# Altium schematic sheet Charger.SchDoc
size A2; SheetNumber: 3; SheetTotal: 9
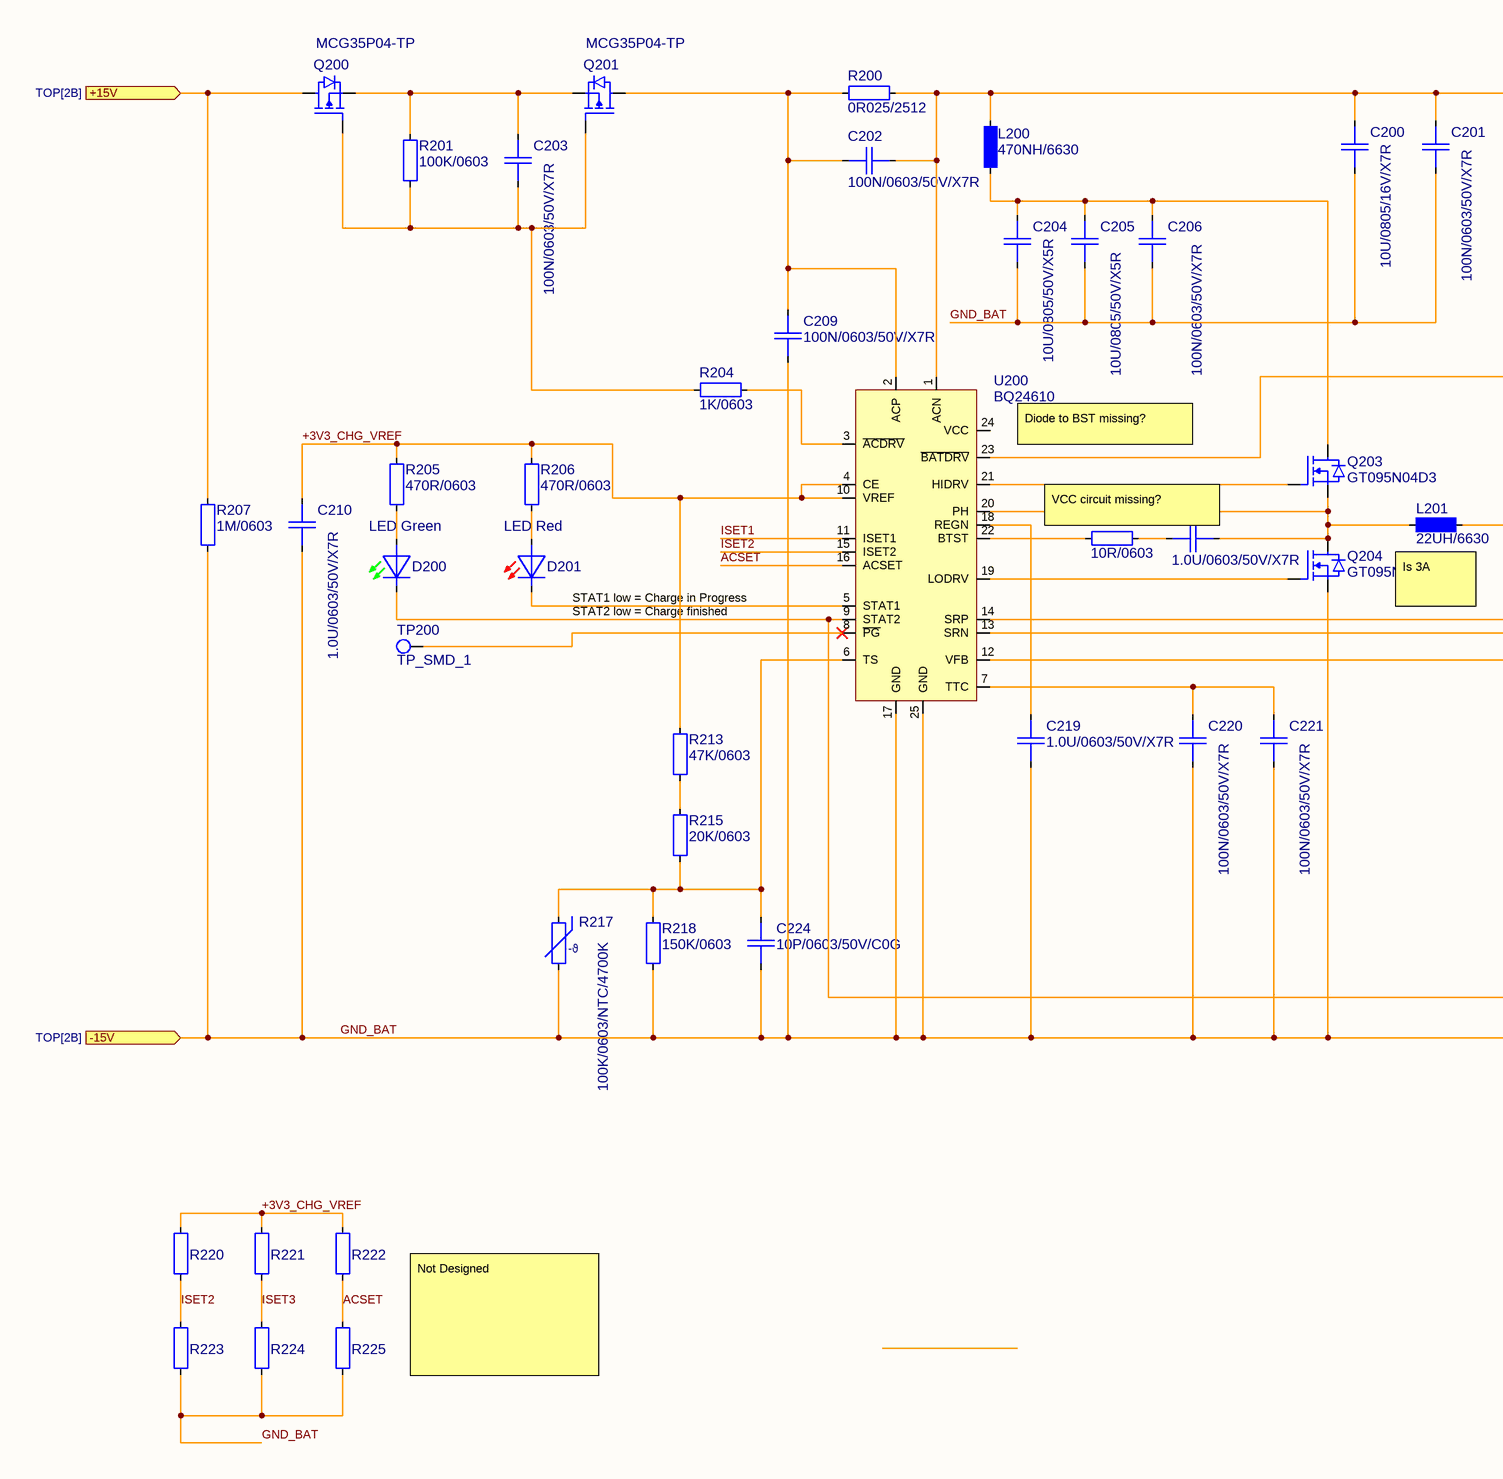
[diagram p0: Charger.SchDoc, left]
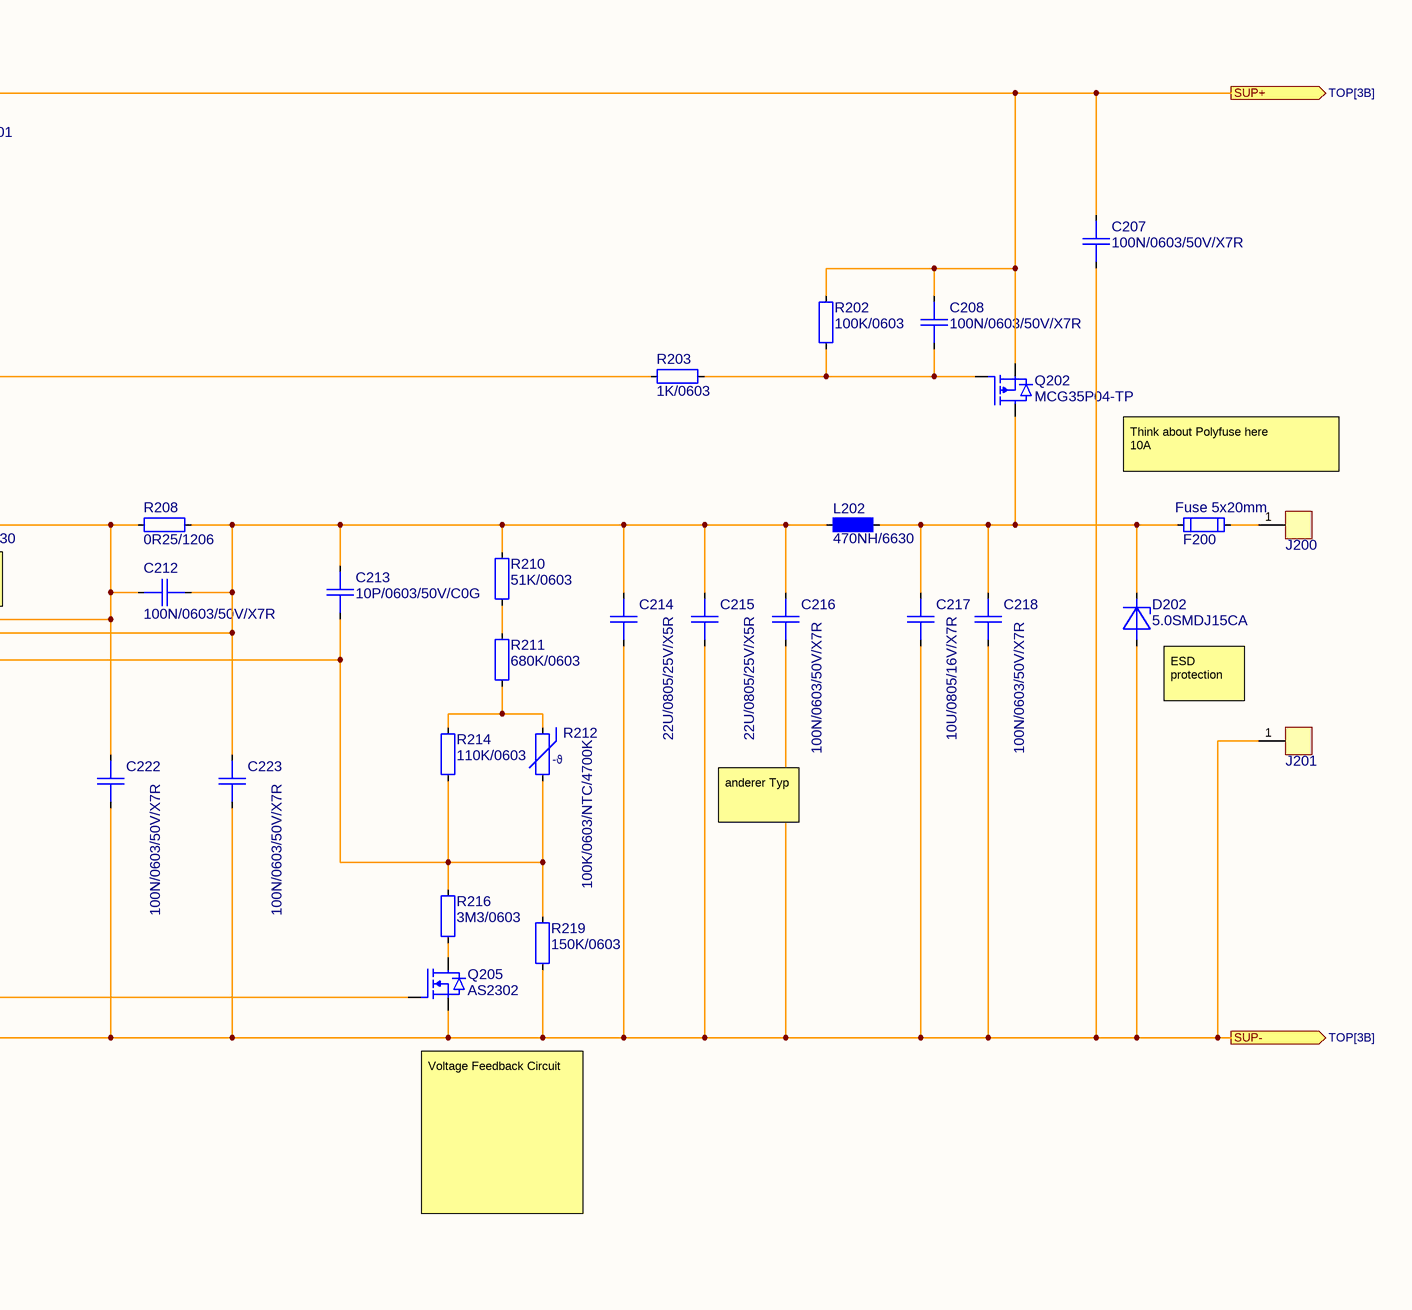
[diagram p1: Charger.SchDoc, right]

## Parts
C200  10U/0805/16V/X7R  [CAP0805_X7R]
C201  100N/0603/50V/X7R  [CAP0603_X7R]
C202  100N/0603/50V/X7R  [CAP0603_X7R]
C203  100N/0603/50V/X7R  [CAP0603_X7R]
C204  10U/0805/50V/X5R  [CAP0805_X7R]
C205  10U/0805/50V/X5R  [CAP0805_X7R]
C206  100N/0603/50V/X7R  [CAP0603_X7R]
C207  100N/0603/50V/X7R  [CAP0603_X7R]
C208  100N/0603/50V/X7R  [CAP0603_X7R]
C209  100N/0603/50V/X7R  [CAP0603_X7R]
C210  1.0U/0603/50V/X7R  [CAP0603_X7R]
C211  1.0U/0603/50V/X7R  [CAP0603_X7R]
C212  100N/0603/50V/X7R  [CAP0603_X7R]
C213  10P/0603/50V/C0G  [CAP0603_C0G]
C214  22U/0805/25V/X5R  [CAP0805_X7R]
C215  22U/0805/25V/X5R  [CAP0805_X7R]
C216  100N/0603/50V/X7R  [CAP0603_X7R]
C217  10U/0805/16V/X7R  [CAP0805_X7R]
C218  100N/0603/50V/X7R  [CAP0603_X7R]
C219  1.0U/0603/50V/X7R  [CAP0603_X7R]
C220  100N/0603/50V/X7R  [CAP0603_X7R]
C221  100N/0603/50V/X7R  [CAP0603_X7R]
C222  100N/0603/50V/X7R  [CAP0603_X7R]
C223  100N/0603/50V/X7R  [CAP0603_X7R]
C224  10P/0603/50V/C0G  [CAP0603_C0G]
D200  LED Green  [LED0603_GREEN]
D201  LED Red  [LED0603_RED]
D202  5.0SMDJ15CA  [DIOM7959X265]
F200  Fuse 5x20mm  [OGN_THR]
J200  6.35mmx0.81mm Tab THT  [Tab_THT_635]  (value not drawn)
J201  6.35mmx0.81mm Tab THT  [Tab_THT_635]  (value not drawn)
L200  470NH/6630  [INDM660730X30]
L201  22UH/6630  [INDM660730X30]
L202  470NH/6630  [INDM660730X30]
Q200  MCG35P04-TP  [SON065P330X330X075-5-TH245X175]
Q201  MCG35P04-TP  [SON065P330X330X075-5-TH245X175]
Q202  MCG35P04-TP  [SON065P330X330X075-5-TH245X175]
Q203  GT095N04D3  [SON065P330X330X075-5-TH245X175]
Q204  GT095N04D3  [SON065P330X330X075-5-TH245X175]
Q205  AS2302  [SOT2395P280X125-3-SE]
R200  0R025/2512  [R2512-0.65-WW]
R201  100K/0603  [R0603-0.40-WW]
R202  100K/0603  [R0603-0.40-WW]
R203  1K/0603  [R0603-0.40-WW]
R204  1K/0603  [R0603-0.40-WW]
R205  470R/0603  [R0603-0.40-WW]
R206  470R/0603  [R0603-0.40-WW]
R207  1M/0603  [R0603-0.40-WW]
R208  0R25/1206  [R1206-0.80-WW]
R209  10R/0603  [R0603-0.40-WW]
R210  51K/0603  [R0603-0.40-WW]
R211  680K/0603  [R0603-0.40-WW]
R212  100K/0603/NTC/4700K  [R0603-0.40-WW]
R213  47K/0603  [R0603-0.40-WW]
R214  110K/0603  [R0603-0.40-WW]
R215  20K/0603  [R0603-0.40-WW]
R216  3M3/0603  [R0603-0.40-WW]
R217  100K/0603/NTC/4700K  [R0603-0.40-WW]
R218  150K/0603  [R0603-0.40-WW]
R219  150K/0603  [R0603-0.40-WW]
R220  10K/0603  [R0603-0.40-WW]  (value not drawn)
R221  10K/0603  [R0603-0.40-WW]  (value not drawn)
R222  10K/0603  [R0603-0.40-WW]  (value not drawn)
R223  10K/0603  [R0603-0.40-WW]  (value not drawn)
R224  10K/0603  [R0603-0.40-WW]  (value not drawn)
R225  10K/0603  [R0603-0.40-WW]  (value not drawn)
TP200  TP_SMD_1  [TP_SMD_1]  (no BOM)
U200  BQ24610  [QFN050P400X400X100-24-TH245X245]

## Ports
+15V (in, see TOP[2B]), -15V (in, see TOP[2B]), SUP+ (out, see TOP[3B]), SUP- (out, see TOP[3B])

## Nets
+3V3_CHG_VREF: C210.1 R205.1 R206.1 R213.1 R220.1 R221.1 R222.1 U200.4(CE) U200.10(VREF)
+15V: Q200.D(DRAIN) R207.1 ; port +15V
ACSET: R222.2 R225.1 U200.16(ACSET)
GND_BAT: C200.2 C201.2 C204.2 C205.2 C206.2 C207.2 C209.2 C210.2 C214.2 C215.2 C216.2 C217.2 C218.2 C219.1 C220.2 C221.2 C222.2 C223.2 C224.2 D202.2 J201.1 Q204.S(SOURCE) Q205.2(SOURCE) R207.2 R217.2 R218.2 R219.2 R223.2 R224.2 R225.2 U200.17(GND) U200.25(GND) ; port -15V, port SUP-
ISET1: U200.11(ISET1)
ISET2: R220.2 R223.1 U200.15(ISET2)
ISET3: R221.2 R224.1
SUP+: C200.1 C201.1 C202.2 C207.1 C208.1 L200.1 Q202.S(SOURCE) R200.2 R202.1 U200.1(ACN) ; port SUP+
NetC202_1: C202.1 C209.1 Q201.D(DRAIN) R200.1 U200.2(ACP)
NetC203_1: C203.1 Q200.S(SOURCE) Q201.S(SOURCE) R201.1
NetC203_2: C203.2 Q200.G(GATE) Q201.G(GATE) R201.2 R204.1
NetC204_1: C204.1 C205.1 C206.1 L200.2 Q203.D(DRAIN)
NetC208_2: C208.2 Q202.G(GATE) R202.2 R203.2
NetC211_1: C211.1 R209.2
NetC211_2: C211.2 L201.1 Q203.S(SOURCE) Q204.D(DRAIN) U200.20(PH)
NetC212_1: C212.1 C222.1 L201.2 R208.1 U200.14(SRP)
NetC212_2: C212.2 C213.1 C214.1 C215.1 C216.1 C223.1 L202.2 R208.2 R210.1 U200.13(SRN)
NetC213_2: C213.2 R212.2 R214.2 R216.1 R219.1 U200.12(VFB)
NetC217_1: C217.1 C218.1 D202.1 F200.1 L202.1 Q202.D(DRAIN)
NetC219_2: C219.2 U200.18(REGN)
NetC220_1: C220.1 C221.1 U200.7(TTC)
NetC224_1: C224.1 R215.2 R217.1 R218.1 U200.6(TS)
NetD200_1: D200.1 Q205.1(GATE) U200.9(STAT2)
NetD200_2: D200.2 R205.2
NetD201_1: D201.1 U200.5(STAT1)
NetD201_2: D201.2 R206.2
NetF200_2: F200.2 J200.1
NetQ203_G: Q203.G(GATE) U200.21(HIDRV)
NetQ204_G: Q204.G(GATE) U200.19(LODRV)
NetQ205_3: Q205.3(DRAIN) R216.2
NetR203_1: R203.1 U200.23(~{BATDRV})
NetR204_2: R204.2 U200.3(~{ACDRV})
NetR209_1: R209.1 U200.22(BTST)
NetR210_2: R210.2 R211.1
NetR211_2: R211.2 R212.1 R214.1
NetR213_2: R213.2 R215.1
NetTP200_1: TP200.1 U200.8(~{PG})

Not connected (* = marked no-connect by the designer): U200 24(VCC)

## Notes on the sheet
- (near U200) Diode to BST missing?
- VCC circuit missing?
- Think about Polyfuse here
  10A
- (near D201) STAT1 low = Charge in Progress
- (near D201) STAT2 low = Charge finished
- (near L201) Is 3A
- (near D202) ESD protection
- anderer Typ
- Voltage Feedback Circuit
- Not Designed
- Date:
- Schema:
- Layout:
- Size:
- A3
- (in symbol 100K/0603/NTC/4700K) -ϑ

## Library data of the parts
C200 C217 = 10U/0805/16V/X7R: CAP SM 0805 10uF 16V X7R; Manufacturer: GENERIC; Manufacturer 1: Cal-Chip Electronics, Inc.; Manufacturer Part Number 1: GMC21X7R106K16NT; Absolute Value: 1E-5; Eurocircuits GPN: GPN0805106-16; Part Number: 10U/0805/16V/X7R; Package: 0805; Value: 10uF; HelpURL: https://88ce57.p3cdn1.secureserver.net/wp-content/uploads/2023/01/gmc_series-2.pdf; Supplier 1: Digi-Key; Supplier Part Number 1: 4713-GMC21X7R106K16NTCT-ND; Manufacturer 2: Samsung Electro-Mechanics; Manufacturer Part Number 2: CL21B106KOQNNNE; Supplier 2: Digi-Key; Supplier Part Number 2: 1276-2872-1-ND; Supplier 3: LCSC; Supplier Part Number 3: C95841; JLC Type: Basic
C201-C203 C206-C209 C212 C216 C218 C220-C223 = 100N/0603/50V/X7R: CAP SM 0603 100nF 50V X7R; Manufacturer: GENERIC; Manufacturer 1: YAGEO; Manufacturer Part Number 1: CC0603KPX7R9BB104; Absolute Value: 1E-7; Eurocircuits GPN: GPC0603104; Part Number: 100N/0603/50V/X7R; Package: 0603; Value: 100nF; HelpURL: https://www.yageo.com/upload/media/product/app/datasheet/mlcc/upy-gphc_x7r_6_3v-to-250v.pdf; Supplier 1: Digi-Key; Supplier Part Number 1: 311-3567-1-ND; Manufacturer 2: YAGEO; Manufacturer Part Number 2: CC0603MRX7R9BB104; Supplier 2: Digi-Key; Supplier Part Number 2: 311-4110-1-ND; Supplier 3: LCSC; Supplier Part Number 3: C14663; JLC Type: Basic
C204 C205 = 10U/0805/50V/X5R: CAP SM 0805 10uF 50V X5R; Manufacturer: GENERIC; Manufacturer 1: Murata Electronics; Manufacturer Part Number 1: GRM21BR61H106KE43K; Absolute Value: 1E-5; Eurocircuits GPN: GPN0805106-50-X5R; Part Number: 10U/0805/50V/X5R; Package: 0805; Value: 10uF; HelpURL: https://search.murata.co.jp/Ceramy/image/img/A01X/G101/ENG/GRM21BR61H106KE43-01A.pdf; Supplier 1: Digi-Key; Supplier Part Number 1: 490-GRM21BR61H106KE43KCT-ND; Manufacturer Part Number 3: GRM21BR61H106KE43L; Supplier 3: LCSC; Supplier Part Number 3: C440198; JLC Type: Basic
C210 C211 C219 = 1.0U/0603/50V/X7R: CAP SM 0603 1.0uF 50V X7R; Manufacturer: GENERIC; Manufacturer 1: YAGEO; Manufacturer Part Number 1: CC0603KRX7R9BB105; Absolute Value: 1E-6; Eurocircuits GPN: GPC0603105; Part Number: 1.0U/0603/50V/X7R; Package: 0603; Value: 1.0uF; HelpURL: https://www.yageo.com/upload/media/product/app/datasheet/mlcc/upy-gphc_x7r_6_3v-to-250v.pdf; Supplier 1: Digi-Key; Supplier Part Number 1: 311-2082-1-ND
C213 C224 = 10P/0603/50V/C0G: CAP SM 0603 10pF 50V C0G; Manufacturer: GENERIC; Manufacturer 1: YAGEO; Manufacturer Part Number 1: CC0603JRNPO9BN100; Absolute Value: 1E-11; Eurocircuits GPN: GPC0603100-C0G; Part Number: 10P/0603/50V/C0G; Package: 0603; Value: 10pF; HelpURL: https://www.yageo.com/upload/media/product/productsearch/datasheet/mlcc/UPY-GP_NP0_16V-to-50V_18.pdf; Supplier 1: Digi-Key; Supplier Part Number 1: 311-1058-1-ND; Manufacturer 2: YAGEO; Manufacturer Part Number 2: CC0603KRNPO9BN100; Supplier 2: Digi-Key; Supplier Part Number 2: 311-4025-1-ND
C214 C215 = 22U/0805/25V/X5R: CAP SM 0805 22uF 25V X5R; Manufacturer: GENERIC; Manufacturer 1: Samsung Electro-Mechanics; Manufacturer Part Number 1: CL21A226MAYNNNE; Absolute Value: 2.2E-5; Eurocircuits GPN: GPN0805106-25; Part Number: 22U/0805/25V/X5R; Package: 0805; Value: 22uF; HelpURL: https://mm.digikey.com/Volume0/opasdata/d220001/medias/docus/339/CL21A226MAYNNNE_Spec.pdf; Supplier 1: Digi-Key; Supplier Part Number 1: 1276-CL21A226MAYNNNECT-ND; Manufacturer Part Number 3: CL21A226MAQNNNE; Supplier 3: LCSC; Supplier Part Number 3: C45783; JLC Type: Basic
D200 = LED Green 0603: Generic LED Green 0603; Manufacturer 1: Würth; Manufacturer Part Number 1: 150060VS75000; Part Number: LED Green 0603; Manufacturer: GENERIC; Package: 603; Value: Green; Absolute Value: Green; HelpURL: https://www.we-online.com/katalog/datasheet/150060VS75000.pdf; Supplier 1: Digi-Key; Supplier Part Number 1: 732-4980-1-ND; Manufacturer 3: Everlight Elec; Manufacturer Part Number 3: 19-217/GHC-YR1S2/3T; Supplier 3: LCSC; Supplier Part Number 3: C72043; JLC Type: Basic
D201 = LED Red 0603: Generic LED Red 0603; Manufacturer 1: Würth; Manufacturer Part Number 1: 150060RS75000; Part Number: LED Red 0603; Manufacturer: GENERIC; Package: 603; Value: Red; Absolute Value: Red; HelpURL: https://www.we-online.com/katalog/datasheet/150060RS75000.pdf; Supplier 1: Digi-Key; Supplier Part Number 1: 732-4978-1-ND; Manufacturer 3: Hubei KENTO Elec; Manufacturer Part Number 3: KT-0603R; Supplier 3: LCSC; Supplier Part Number 3: C2286; JLC Type: Basic
D202 = 5.0SMDJ15CA: TVS DIODE 15VWM 24.4V DO214 TR13; Manufacturer: Littelfuse Inc.; Manufacturer Part Number 1: 5.0SMDJ15CAS; Absolute Value: 15V; Part Number: 5.0SMDJ15CA; Package: DO-214AB, SMC; Value: 5.0SMDJ15CA; HelpURL: https://m.littelfuse.com/~/media/electronics/datasheets/tvs_diodes/littelfuse_tvs_diode_5_0smdjxxs_datasheet.pdf.pdf; Manufacturer 1: Littelfuse Inc.; Supplier 1: Digi-Key; Supplier Part Number 1: 18-5.0SMDJ15CASCT-ND; Manufacturer 2: Littelfuse Inc.; Manufacturer Part Number 2: 5.0SMDJ15CA; Supplier 2: Digi-Key; Supplier Part Number 2: 5.0SMDJ15CACT-ND
F200 = Fuse/5x20mm/OGN: open fuse holder, 5 x 20 mm, THR, IEC 60335-1; Manufacturer: Schurter; Manufacturer Part Number 1: 3-132-873; Part Number: Fuse/5x20mm/OGN; Package: 5X20; HelpURL: https://www.schurter.com/en/datasheet/typ_OGN.pdf; Manufacturer 1: Schurter; Supplier 1: Digi-Key; Supplier Part Number 1: 486-3-132-873-ND
J200 J201 = Tab_025_THT: CONN QC TAB 0.250 SOLDER; Manufacturer: GENERIC; Manufacturer 1: TE Connectivity AMP Connectors; Manufacturer Part Number 1: 1217861-1; Part Number: Tab_025_THT; HelpURL: https://www.te.com/usa-en/product-1217861-1.datasheet.pdf; Supplier 1: Digi-Key; Supplier Part Number 1: A100452CT-ND; Manufacturer 3: TE Connectivity; Manufacturer Part Number 3: 1217861-1; Supplier 3: LCSC; Supplier Part Number 3: C428480
L200 L202 = 470NH/6630: FIXED IND 470NH 16.5 A 5.5 MOHM SMD; Manufacturer: GENERIC; Manufacturer 1: Pulse Electronics; Manufacturer Part Number 1: BMRA00060630R47MA1; Absolute Value: 4.7E-7; Part Number: 470NH/6630; Package: 6030 Inductor; Value: 470NH; HelpURL: https://productfinder.pulseelectronics.com/api/open/part-attachments/datasheet/BMRA00060630R47MA1; Supplier 1: Digi-Key; Supplier Part Number 1: 553-BMRA00060630R47MA1CT-ND
L201 = 22UH/6630: FIXED IND 22UH     3 A 145 MOHM SMD; Manufacturer: GENERIC; Manufacturer 1: Pulse Electronics; Manufacturer Part Number 1: BMRA00060630220MA1; Absolute Value: 2.2E-5; Part Number: 22UH/6630; Package: 6030 Inductor; Value: 22UH; HelpURL: https://productfinder.pulseelectronics.com/api/open/part-attachments/datasheet/BMRA00060630220MA1; Supplier 1: Digi-Key; Supplier Part Number 1: 553-BMRA00060630220MA1CT-ND
Q200-Q202 = MCG35P04-TP: 40V 35A P-Channel MOSFET; Manufacturer: Micro Commercial Co; Manufacturer Part Number 1: 353-MCG35P04-TPCT-ND; Part Number: MCG35P04-TP; HelpURL: https://www.mccsemi.com/pdf/Products/MCG35P04(DFN3333).pdf; Manufacturer 1: Micro Commercial Co; Supplier 1: Digi-Key; Supplier Part Number 1: 353-MCG35P04-TPCT-ND
Q203 Q204 = GT095N04D3: 40V 47A N-Channel MOSFET; Manufacturer: Goford Semiconductor; Part Number: GT095N04D3; HelpURL: http://www.gofordsemi.com/u_file/product/834/GOFORD-GT095N04D3.pdf; Manufacturer 1: Goford Semiconductor; Manufacturer Part Number 1: GT095N04D3; Supplier 1: Digi-Key; Supplier Part Number 1: 3141-GT095N04D3CT-ND
Q205 = AS2302: N-Channel 20V(D-S) MOSFET; Manufacturer: GENERIC; Manufacturer 1: ANBON SEMICONDUCTOR (INT'L) LIMITED; Part Number: AS2302; Package: SOT23; HelpURL: https://datasheet.lcsc.com/lcsc/1809211431_AnBon-AS2302_C232266.pdf; Manufacturer Part Number 1: AS2302; Supplier 1: Digi-Key; Supplier Part Number 1: 4530-AS2302CT-ND; Manufacturer 3: AnBon; Manufacturer Part Number 3: AS2302; Supplier 3: LCSC; Supplier Part Number 3: C232266; JLC Type: Extended
R200 = 0R025/2512: RES SM 2512 0R025; Manufacturer: GENERIC; Manufacturer 1: Ohmite; Manufacturer Part Number 1: MCS3264R025FER; Absolute Value: 0.025; Part Number: 0R025/2512; Package: 2512; Value: 0R025; HelpURL: https://www.ohmite.com/assets/docs/res_mcs.pdf?r=false; Supplier 1: Digi-Key; Supplier Part Number 1: MCS3264R025FERCT-ND
R201 R202 = 100K/0603: RES SM 0603 100K; Manufacturer: GENERIC; Manufacturer 1: YAGEO; Manufacturer Part Number 1: RC0603FR-13100KL; Absolute Value: 100000; Eurocircuits GPN: GPR0603100K; Part Number: 100K/0603; Package: 0603; Value: 100K; HelpURL: https://www.yageo.com/upload/media/product/productsearch/datasheet/rchip/PYu-RC_Group_51_RoHS_L_12.pdf; Supplier 1: Digi-Key; Supplier Part Number 1: 13-RC0603FR-13100KLCT-ND; Manufacturer 2: YAGEO; Manufacturer Part Number 2: RC0603FR-10100KL; Supplier 2: Digi-Key; Supplier Part Number 2: 13-RC0603FR-10100KLCT-ND; Manufacturer 3: UNI-ROYAL(Uniroyal Elec); Manufacturer Part Number 3: 0603WAF1003T5E; Supplier 3: LCSC; Supplier Part Number 3: C25803; JLC Type: Basic
R203 R204 = 1K/0603: RES SM 0603 1K; Manufacturer: GENERIC; Manufacturer 1: YAGEO; Manufacturer Part Number 1: RC0603FR-131KL; Absolute Value: 1000; Eurocircuits GPN: GPR06031K; Part Number: 1K/0603; Package: 0603; Value: 1K; HelpURL: https://www.yageo.com/upload/media/product/app/datasheet/rchip/pyu-rc_group_51_rohs_l.pdf; Supplier 1: Digi-Key; Supplier Part Number 1: 13-RC0603FR-131KLCT-ND; Manufacturer 2: YAGEO; Manufacturer Part Number 2: RC0603FR-101KL; Supplier 2: Digi-Key; Supplier Part Number 2: 13-RC0603FR-101KLCT-ND; Manufacturer 3: UNI-ROYAL(Uniroyal Elec); Manufacturer Part Number 3: 0603WAF1001T5E; Supplier 3: LCSC; Supplier Part Number 3: C21190; JLC Type: Basic
R205 R206 = 470R/0603: RES SM 0603 470R; Manufacturer: GENERIC; Manufacturer 1: YAGEO; Manufacturer Part Number 1: RC0603FR-13470RL; Absolute Value: 470; Eurocircuits GPN: GPR0603470R; Part Number: 470R/0603; Package: 0603; Value: 470R; HelpURL: https://www.yageo.com/upload/media/product/app/datasheet/rchip/pyu-rc_group_51_rohs_l.pdf; Supplier 1: Digi-Key; Supplier Part Number 1: 13-RC0603FR-13470RLCT-ND; Manufacturer 2: YAGEO; Manufacturer Part Number 2: RC0603FR-10470RL; Supplier 2: Digi-Key; Supplier Part Number 2: 13-RC0603FR-10470RLCT-ND
R207 = 1M/0603: RES SM 0603 1M; Manufacturer: GENERIC; Manufacturer 1: YAGEO; Manufacturer Part Number 1: RC0603FR-131ML; Absolute Value: 1000000; Eurocircuits GPN: GPR06031M; Part Number: 1M/0603; Package: 0603; Value: 1M; HelpURL: https://www.yageo.com/upload/media/product/app/datasheet/rchip/pyu-rc_group_51_rohs_l.pdf; Supplier 1: Digi-Key; Supplier Part Number 1: 13-RC0603FR-131MLCT-ND; Manufacturer 2: YAGEO; Manufacturer Part Number 2: RC0603FR-101ML; Supplier 2: Digi-Key; Supplier Part Number 2: 13-RC0603FR-101MLCT-ND; Manufacturer 3: UNI-ROYAL(Uniroyal Elec); Manufacturer Part Number 3: 0603WAF1004T5E; Supplier 3: C22935; Supplier Part Number 3: LCSC; JLC Type: Basic
R208 = 0R25/1206: RES SM 1206 0R25; Manufacturer: GENERIC; Manufacturer 1: YAGEO; Manufacturer Part Number 1: RC1206FR-0715RL; Absolute Value: 0.25; Eurocircuits GPN: GPR12060R25; Part Number: 0R25/1206; Package: 1206; Value: 0R25; HelpURL: https://www.yageo.com/upload/media/product/app/datasheet/rchip/pyu-rl_group_521_rohs_l.pdf; Supplier 1: Digi-Key; Supplier Part Number 1: 311-.25LWCT-ND; Manufacturer 3: RALEC; Manufacturer Part Number 3: RLT06R25JTP; Supplier 3: LCSC; Supplier Part Number 3: C7500327
R209 = 10R/0603: RES SM 0603 10R; Manufacturer: GENERIC; Manufacturer 1: YAGEO; Manufacturer Part Number 1: RC0603FR-1310RL; Absolute Value: 10; Eurocircuits GPN: GPR060310R; Part Number: 10R/0603; Package: 0603; Value: 10R; HelpURL: https://www.yageo.com/upload/media/product/app/datasheet/rchip/pyu-rc_group_51_rohs_l.pdf; Supplier 1: Digi-Key; Supplier Part Number 1: 13-RC0603FR-1310RLCT-ND; Manufacturer 2: YAGEO; Manufacturer Part Number 2: RC0603FR-1010RL; Supplier 2: Digi-Key; Supplier Part Number 2: 13-RC0603FR-1010RLCT-ND
R210 = 51K/0603: RES SM 0603 51K; Manufacturer: GENERIC; Manufacturer 1: YAGEO; Manufacturer Part Number 1: RC0603FR-1351KL; Absolute Value: 51000; Eurocircuits GPN: GPR060351K; Part Number: 51K/0603; Package: 0603; Value: 51K; HelpURL: https://www.yageo.com/upload/media/product/app/datasheet/rchip/pyu-rc_group_51_rohs_l.pdf; Supplier 1: Digi-Key; Supplier Part Number 1: 13-RC0603FR-1351KLCT-ND; Manufacturer 2: YAGEO; Manufacturer Part Number 2: RC0603FR-1051KL; Supplier 2: Digi-Key; Supplier Part Number 2: 13-RC0603FR-1051KLCT-ND; Supplier 3: LCSC; Supplier Part Number 3: C2933234; JLC Type: Basic
R211 = 680K/0603: RES SM 0603 680K; Manufacturer: GENERIC; Manufacturer 1: YAGEO; Manufacturer Part Number 1: RC0603FR-13680KL; Absolute Value: 680000; Eurocircuits GPN: GPR0603680K; Part Number: 680K/0603; Package: 0603; Value: 680K; HelpURL: https://www.yageo.com/upload/media/product/app/datasheet/rchip/pyu-rc_group_51_rohs_l.pdf; Supplier 1: Digi-Key; Supplier Part Number 1: 13-RC0603FR-13680KLCT-ND; Manufacturer 2: YAGEO; Manufacturer Part Number 2: RC0603FR-07680KL; Supplier 2: Digi-Key; Supplier Part Number 2: 311-680KHRCT-ND
R212 R217 = 100K/0603/NTC/4700K: RES NTC SM 0603 100k 4700K; Manufacturer: GENERIC; Manufacturer 1: Panasonic Electronic Components; Manufacturer Part Number 1: ERT-J1VV104F; Absolute Value: 100000; Part Number: 100K/0603/NTC/4700K; Package: 0603; Value: 100K; HelpURL: https://industrial.panasonic.com/cdbs/www-data/pdf/AUA0000/AUA0000C8.pdf; Supplier 1: Digi-Key; Supplier Part Number 1: P124047CT-ND
R213 = 47K/0603: RES SM 0603 47K; Manufacturer: GENERIC; Manufacturer 1: YAGEO; Manufacturer Part Number 1: RC0603FR-1347KL; Absolute Value: 47000; Eurocircuits GPN: GPR060347K; Part Number: 47K/0603; Package: 0603; Value: 47K; HelpURL: https://www.yageo.com/upload/media/product/app/datasheet/rchip/pyu-rc_group_51_rohs_l.pdf; Supplier 1: Digi-Key; Supplier Part Number 1: 13-RC0603FR-1347KLCT-ND; Manufacturer 2: YAGEO; Manufacturer Part Number 2: RC0603FR-1047KL; Supplier 2: Digi-Key; Supplier Part Number 2: 13-RC0603FR-1047KLCT-ND; Manufacturer 3: UNI-ROYAL(Uniroyal Elec); Manufacturer Part Number 3: 0603WAF4702T5E; Supplier 3: LCSC; Supplier Part Number 3: C25819; JLC Type: Basic
R214 = 110K/0603: RES SM 0603 110K; Manufacturer: GENERIC; Manufacturer 1: YAGEO; Manufacturer Part Number 1: RC0603FR-13110KL; Absolute Value: 110000; Eurocircuits GPN: GPR0603110K; Part Number: 110K/0603; Package: 0603; Value: 110K; HelpURL: https://www.yageo.com/upload/media/product/productsearch/datasheet/rchip/PYu-RC_Group_51_RoHS_L_12.pdf; Supplier 1: Digi-Key; Supplier Part Number 1: 13-RC0603FR-13110KLCT-ND; Manufacturer 2: YAGEO; Manufacturer Part Number 2: RC0603FR-07110KL; Supplier 2: Digi-Key; Supplier Part Number 2: 311-110KHRCT-ND
R215 = 20K/0603: RES SM 0603 20K; Manufacturer: GENERIC; Manufacturer 1: YAGEO; Manufacturer Part Number 1: RC0603FR-1320KL; Absolute Value: 20000; Eurocircuits GPN: GPR060320K; Part Number: 20K/0603; Package: 0603; Value: 20K; HelpURL: https://www.yageo.com/upload/media/product/app/datasheet/rchip/pyu-rc_group_51_rohs_l.pdf; Supplier 1: Digi-Key; Supplier Part Number 1: 13-RC0603FR-1320KLCT-ND; Manufacturer 2: YAGEO; Manufacturer Part Number 2: RC0603FR-1020KL; Supplier 2: Digi-Key; Supplier Part Number 2: 13-RC0603FR-1020KLCT-ND
R216 = 3M3/0603: RES SM 0603 3M3; Manufacturer: GENERIC; Manufacturer 1: YAGEO; Manufacturer Part Number 1: RC0603FR-073M3L; Absolute Value: 3300000; Eurocircuits GPN: GPR06033M3; Part Number: 3M3/0603; Package: 0603; Value: 3M3; HelpURL: https://www.yageo.com/upload/media/product/app/datasheet/rchip/pyu-rc_group_51_rohs_l.pdf; Supplier 1: Digi-Key; Supplier Part Number 1: 13-RC0603FR-073M3LCT-ND
R218 R219 = 150K/0603: RES SM 0603 150K; Manufacturer: GENERIC; Manufacturer 1: YAGEO; Manufacturer Part Number 1: RC0603FR-13150KL; Absolute Value: 150000; Eurocircuits GPN: GPR0603150K; Part Number: 150K/0603; Package: 0603; Value: 150K; HelpURL: https://www.yageo.com/upload/media/product/app/datasheet/rchip/pyu-rc_group_51_rohs_l.pdf; Supplier 1: Digi-Key; Supplier Part Number 1: 13-RC0603FR-13150KLCT-ND; Manufacturer 2: YAGEO; Manufacturer Part Number 2: RC0603FR-10150KL; Supplier 2: Digi-Key; Supplier Part Number 2: 13-RC0603FR-10150KLCT-ND; Manufacturer 3: UNI-ROYAL(Uniroyal Elec); Manufacturer Part Number 3: 0603WAF1503T5E; Supplier 3: LCSC; Supplier Part Number 3: C22807; JLC Type: Basic
R220-R225 = 10K/0603: RES SM 0603 10K; Manufacturer: GENERIC; Manufacturer 1: YAGEO; Manufacturer Part Number 1: RC0603FR-1310KL; Absolute Value: 10000; Eurocircuits GPN: GPR060310K; Part Number: 10K/0603; Package: 0603; Value: 10K; HelpURL: https://www.yageo.com/upload/media/product/productsearch/datasheet/rchip/PYu-RC_Group_51_RoHS_L_12.pdf; Supplier 1: Digi-Key; Supplier Part Number 1: 13-RC0603FR-1310KLCT-ND; Manufacturer 2: YAGEO; Manufacturer Part Number 2: RC0603FR-1010KL; Supplier 2: Digi-Key; Supplier Part Number 2: 13-RC0603FR-1010KLCT-ND; Manufacturer 3: UNI-ROYAL(Uniroyal Elec); Manufacturer Part Number 3: 0603WAF1002T5E; Supplier 3: LCSC; Supplier Part Number 3: C25804; JLC Type: Basic
TP200 = TP_SMD_1: SMD Test Point 1mm; Manufacturer: NONE; Part Number: TP_SMD_1
U200 = BQ24610: BQ2461x Stand-Alone 1- to 6-Cell Synchronous Buck Battery Charger Controller; Manufacturer: Texas Instruments; Manufacturer Part Number 1: BQ24610RGER; Part Number: BQ24610; Package: QFN-24; HelpURL: https://www.ti.com/lit/ds/symlink/bq24610.pdf; Manufacturer 1: Texas Instruments; Supplier 1: Digi-Key; Supplier Part Number 1: 296-29437-1-ND; Manufacturer 3: Texas Instruments; Manufacturer Part Number 3: BQ24610RGER; Supplier 3: LCSC; Supplier Part Number 3: C19384